# Altium schematic sheet CLOCK_GENERATOR.SchDoc: CLOCK_GENERATOR
size A4; DocumentNumber: 6; Revision: 2.0; SheetNumber: 6; SheetTotal: 18
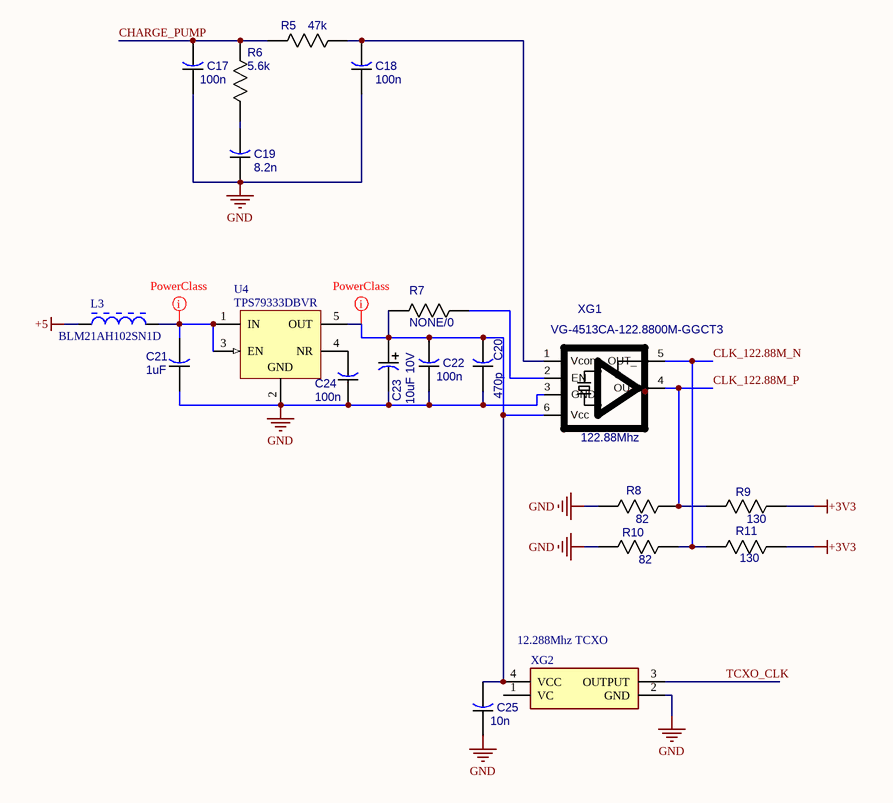
[diagram p0: CLOCK_GENERATOR.SchDoc]

## Parts
C17  100n  [CAP_0805]
C18  100n  [CAP_0805]
C19  8.2n  [CAP_0805]
C20  470p  [CAP_0805]
C21  1uF  [CAP_0805]
C22  100n  [CAP_0805]
C23  10uF 10V  [CAPAE_4.3x4.3h5.4]
C24  100n  [CAP_0805]
C25  10n  [CAP_0805]
L3  BLM21AH102SN1D  [INDC2013X105X50NL20T20]
R5  47k  [RES_0805]
R6  5.6k  [RES_0805]
R7  value NONE/0  [RES_0805]  (hidden comment: 0/NONE)
R8  82  [RES_0805]
R9  130  [RES_0805]
R10  82  [RES_0805]
R11  130  [RES_0805]
U4  TPS79333DBVR  [DBV0005A_L]
XG1  VG-4513CA-122.8800M-GGCT3  value 122.88Mhz  [NV7050SA]
XG2  12.288Mhz TCXO  [581L200X2ITT]

## Nets
+3V3: R9.1 R11.1
+5: L3.1
GND: C17.1 C18.1 C19.1 C20.1 C21.1 C22.1 C23.2(MINUS) C24.1 C25.1 R8.2 R10.2 U4.2(GND) XG1.3(GND) XG2.2(GND)
CHARGE_PUMP: C17.2 R5.1 R6.1
CLK_122.88M_N: R10.1 R11.2 XG1.5(OUT_)
CLK_122.88M_P: R8.1 R9.2 XG1.4(OUT)
TCXO_CLK: XG2.3(OUTPUT)
NetC18_2: C18.2 R5.2 XG1.1(Vcont)
NetC19_2: C19.2 R6.2
NetC20_2: C20.2 C22.2 C23.1(PLUS) C25.2 R7.1 U4.5(OUT) XG1.6(Vcc) XG2.4(VCC)
NetC21_2: C21.2 L3.2 U4.1(IN) U4.3(EN)
NetC24_2: C24.2 U4.4(NR)
NetR7_2: R7.2 XG1.2(EN)

Not connected (* = marked no-connect by the designer): XG2 1(VC)

## Layout directives
net class PowerPads: NetC20_2, NetC21_2

## Notes on the sheet
- Title
- Size:
- Date:
- A4
- Number:
- Time:
- Revision:
- Sheet
- of
- File:

## Library data of the parts
C17-C22 C24 C25 = CAP_0805
  C20: Value: 470p
  C21: Value: 1uF
  C22 C24: Value: 100n
  C25: Value: 10n
C23 = CAPAE_4.3x4.3h5.4: Value: 10uF 10V
L3 = CMP-2000-05954-1: Chip Bead, 1000 Ohm, +/- 25%, 200 mA, -55 to 85 degC, 2-Pin SMD, RoHS, Tape and Reel; Manufacturer: Murata; Brand: MurataElectronics; Test Frequency: 100MHz; Maximum DC Resistance: 450mOhms; Case Length: 2mm; Maximum DC Current: 200mA; Case Height: 0.85mm; Case Width: 1.25mm; Impedance: 1kOhms; Datasheet URL: http://datasheet.octopart.com/BLM21AH102SN1D-Murata-datasheet-629859.pdf; Datasheet Version: 11/2017; Dimensions: 1.25mmWx2mmLx0.85mmH; Manufacturer URL: http://www.murata.com/; Packaging: Reel; Product: FerriteChipBeads; Product Category: EMIFilterBeads,Chips&Arrays; Operating Temperature Range: -55Cto+125C; Package / Case: 0805(2012metric); Series: BLM21A; Mounting Technology: SurfaceMount; Termination Style: SMD/SMT; Tolerance: 25%; RoHS: Details; Package Reference: 0805; Factory Pack Quantity: 4000; Package Description: 2-Pin Surface Mount Device, Body 2 x1.25 mm
R5 R6 R8-R11 = RES_0805
  R8 R10: Value: 82
  R9 R11: Value: 130
R7 = RES_0805: By used crystal
U4 = CMP-0394-00364-2: Single Output High PSRR LDO, 200 mA, Fixed 3.3 V Output, 2.7 to 5.5 V Input, 5-pin SOT-23 (DBV), -40 to 85 degC, Green (RoHS & no Sb/Br); Manufacturer: Texas Instruments; Iout(Max)(A): 0.2; Rating: Catalog; Vin(Min)(V): 2.7; Vdo(Typ)(mV): 102; Fixed Output Options(V): 3.3; Accuracy(%): 2; SubFamily: Single Channel LDO; Vin(Max)(V): 5.5; ComponentLink1URL: http://www.ti.com/; ComponentLink2URL: http://www.ti.com/general/docs/lit/getliterature.tsp?genericPartNumber=TPS79333&fileType=pdf; ComponentLink1Description: Manufacturer URL; PackageDescription: 5-Pin Plastic Small Outline, Body 1.60 Ãƒâ€” 2.90 mm, Pitch 0.95 mm; ComponentLink3URL: http://www.ti.com/litv/pdf/mpds018i; ComponentLink2Description: Datasheet; Mounting Technology: Surface Mount; ComponentLink3Description: Package Specification; PackageReference: DBV0005A; Code_JEDEC: MO-178; PartNumber: TPS79333DBVR; Vout Adj(Min)(V): 3.3; DatasheetVersion: SLVS348K; Eco-Plan: Green (RoHS & no Sb/Br); PackageVersion: 4073253-4/K; Vout Adj(Max)(V): 3.3; Iq(Typ)(mA): 0.2
XG1 = NV7050SA: NV7050SA VG-4513CA-122.8800M-GGCT3
XG2 = 581L200X2ITT: Crystal or Oscillator; Manufacturer_Name: CTS; Datasheet Link: https://componentsearchengine.com/Datasheets/1/581L200X2ITT.pdf; Height: 1.65mm; Manufacturer_Part_Number: 581L200X2ITT; Mouser Part Number: 774-581L200X2ITT; Mouser Price/Stock: https://www.mouser.com/Search/Refine.aspx?Keyword=774-581L200X2ITT